# EAGLE design Thermocouple_datalogger_RevA (EAGLE 7.5.0)
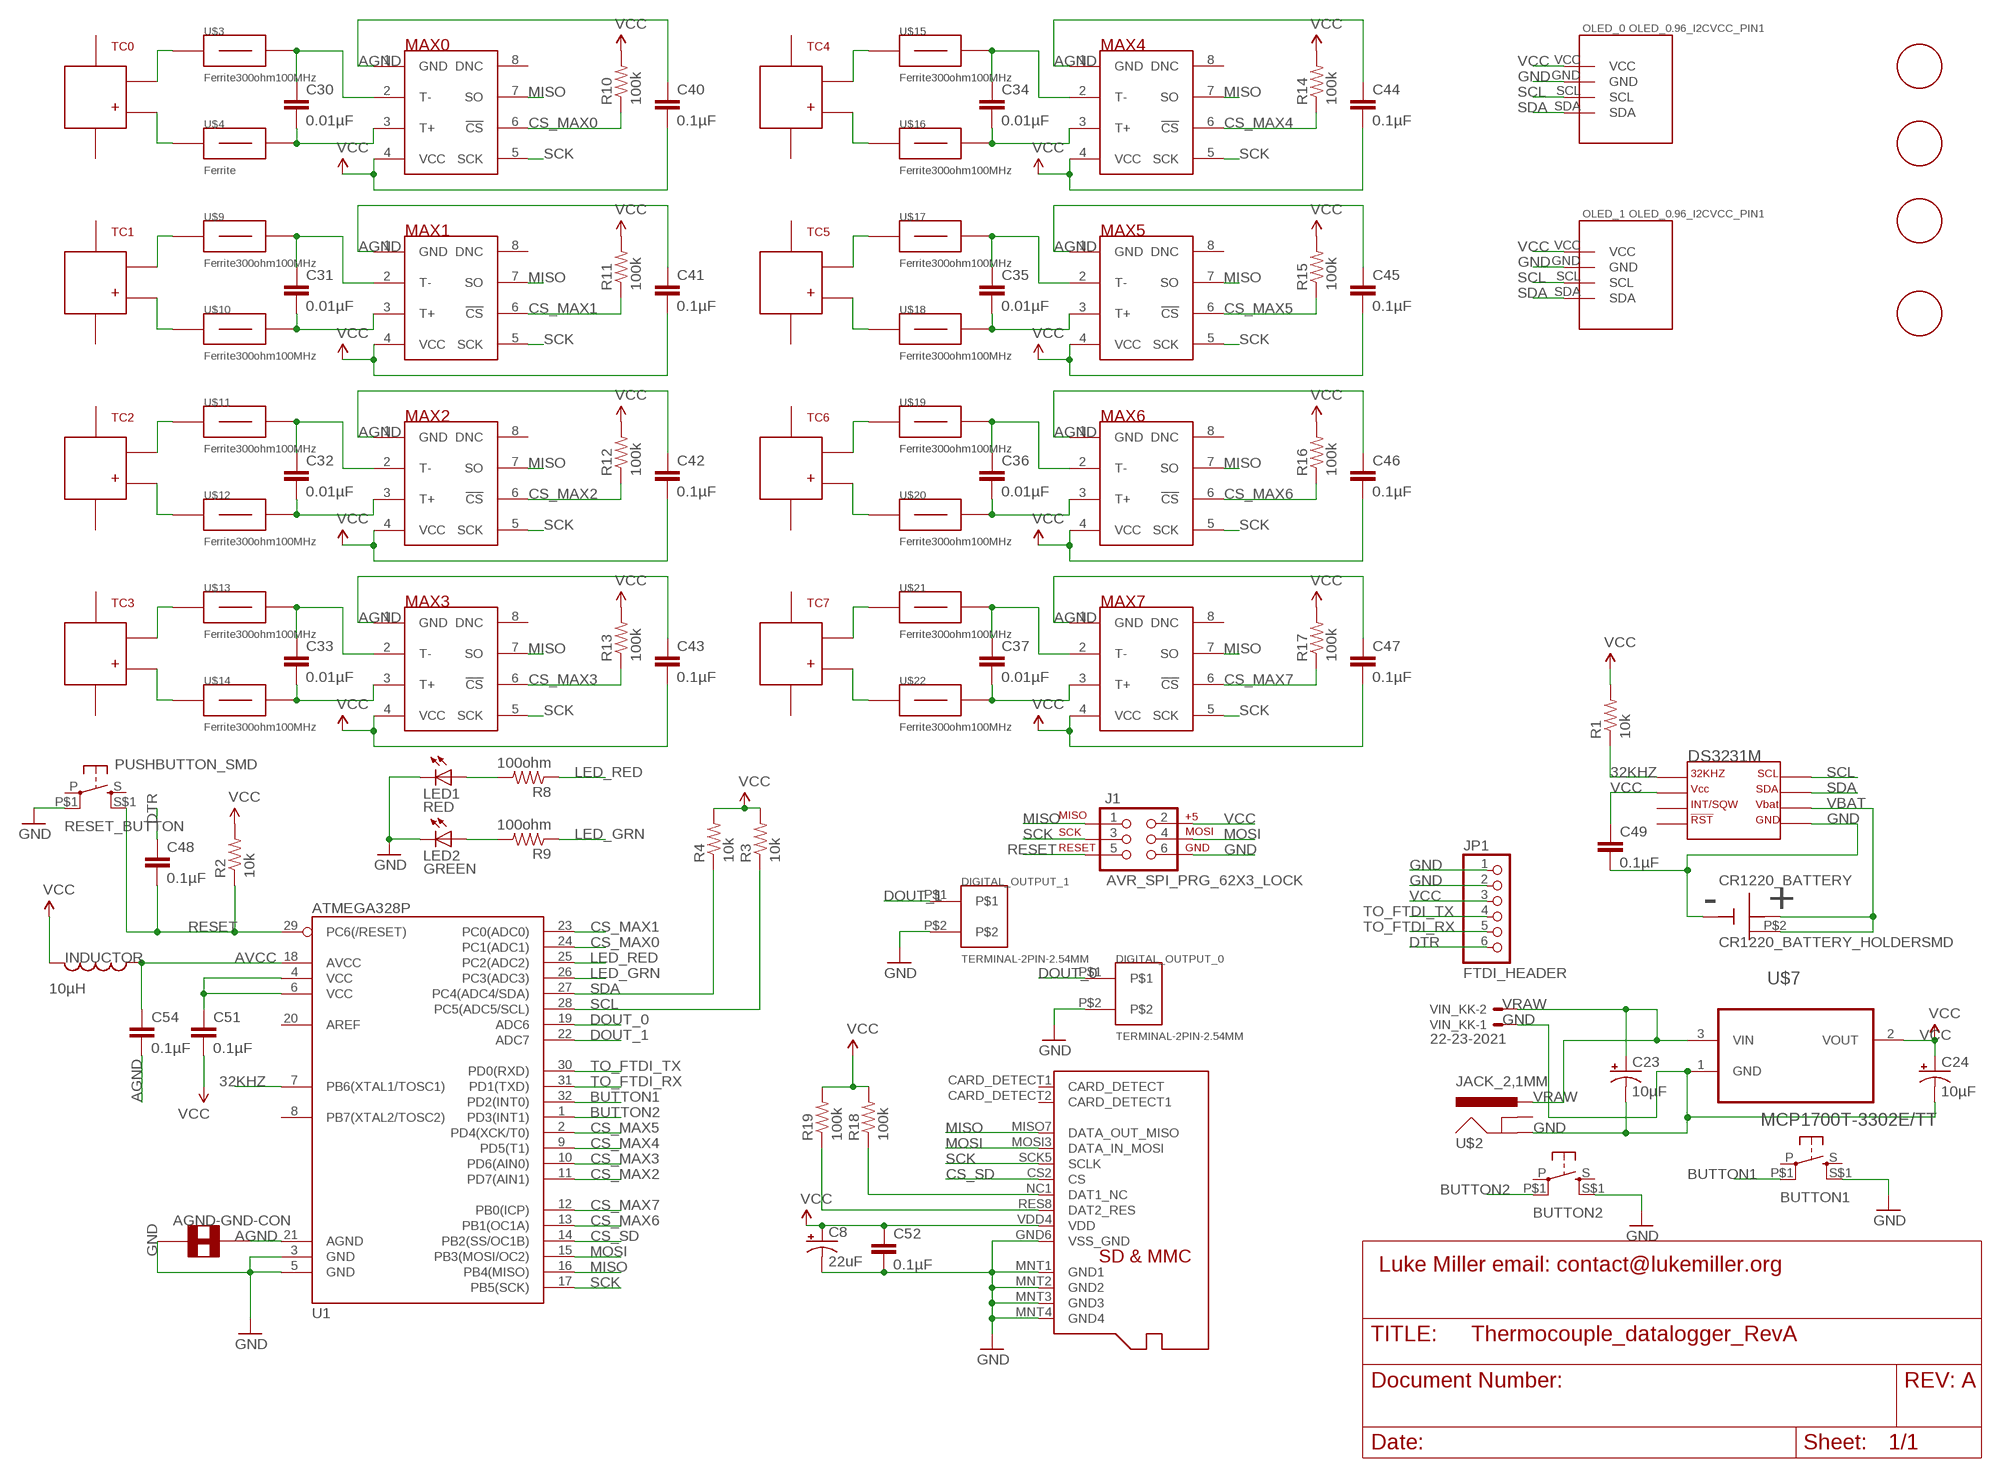
[diagram p0: schematic, sheet 1]

## Parts
AGND-GND-CON  SOLDER_JUMPER_TRACESTANDARD  [SJ_2S-TRACE]
BUTTON1  PUSHBUTTON_DPST_SMDSTANDARD  [PUSHBUTTON_DPST_SMD]
BUTTON2  PUSHBUTTON_DPST_SMDSTANDARD  [PUSHBUTTON_DPST_SMD]
C8  22uF  CPOL-US0805  [C0805_POL]
C23  10µF  CPOL-USB  [PANASONIC_B]
C24  10µF  CPOL-USB  [PANASONIC_B]
C30  0.01µF  CAP0805  [0805]
C31  0.01µF  CAP0805  [0805]
C32  0.01µF  CAP0805  [0805]
C33  0.01µF  CAP0805  [0805]
C34  0.01µF  CAP0805  [0805]
C35  0.01µF  CAP0805  [0805]
C36  0.01µF  CAP0805  [0805]
C37  0.01µF  CAP0805  [0805]
C40  0.1µF  CAP0805  [0805]
C41  0.1µF  CAP0805  [0805]
C42  0.1µF  CAP0805  [0805]
C43  0.1µF  CAP0805  [0805]
C44  0.1µF  CAP0805  [0805]
C45  0.1µF  CAP0805  [0805]
C46  0.1µF  CAP0805  [0805]
C47  0.1µF  CAP0805  [0805]
C48  0.1µF  CAP0805  [0805]
C49  0.1µF  CAP0805  [0805]
C51  0.1µF  CAP0805  [0805]
C52  0.1µF  CAP0805  [0805]
C54  0.1µF  CAP0805  [0805]
CR1220_BATTERY  CR1220_BATTERY_HOLDERSMD  [CR1220_BATTERY_HOLDER_SMD]
DIGITAL_OUTPUT_0  TERMINAL-2PIN-2.54MM  [TERMINAL-2PIN-2.54MM]
DIGITAL_OUTPUT_1  TERMINAL-2PIN-2.54MM  [TERMINAL-2PIN-2.54MM]
DS3231M  DS3231MSOIC-8  [DS3231M_SOIC8]
INDUCTOR  10µH  INDUCTOR0805_TY  [I_0805]
J1  AVR_SPI_PRG_62X3_LOCK  [2X3_LOCK]
JP1  FTDI_HEADER  PINHD-1X6LOCK  [1X06-BIGLOCK]
LED1  RED  LED0805  [CHIPLED_0805]
LED2  GREEN  LED0805  [CHIPLED_0805]
MAX0  MAX31855  [SO08]
MAX1  MAX31855  [SO08]
MAX2  MAX31855  [SO08]
MAX3  MAX31855  [SO08]
MAX4  MAX31855  [SO08]
MAX5  MAX31855  [SO08]
MAX6  MAX31855  [SO08]
MAX7  MAX31855  [SO08]
OLED_0  OLED_0.96_I2CVCC_PIN1  [OLED_0.96_I2C_VCC_PIN1]
OLED_1  OLED_0.96_I2CVCC_PIN1  [OLED_0.96_I2C_VCC_PIN1]
R1  10k  RESISTOR_SMDR0805  [R0805]
R2  10k  RESISTOR_SMDR0805  [R0805]
R3  10k  RESISTOR_SMDR0805  [R0805]
R4  10k  RESISTOR_SMDR0805  [R0805]
R8  100ohm  RESISTOR_SMDR0805  [R0805]
R9  100ohm  RESISTOR_SMDR0805  [R0805]
R10  100k  RESISTOR_SMDR0805  [R0805]
R11  100k  RESISTOR_SMDR0805  [R0805]
R12  100k  RESISTOR_SMDR0805  [R0805]
R13  100k  RESISTOR_SMDR0805  [R0805]
R14  100k  RESISTOR_SMDR0805  [R0805]
R15  100k  RESISTOR_SMDR0805  [R0805]
R16  100k  RESISTOR_SMDR0805  [R0805]
R17  100k  RESISTOR_SMDR0805  [R0805]
R18  100k  RESISTOR_SMDR0805  [R0805]
R19  100k  RESISTOR_SMDR0805  [R0805]
RESET_BUTTON  PUSHBUTTON_SMD  PUSHBUTTON_DPST_SMDSTANDARD  [PUSHBUTTON_DPST_SMD]
TC0  PCC-SMP-THERMOCOUPLEVERTICAL  [PCC-SMP-V]
TC1  PCC-SMP-THERMOCOUPLEVERTICAL  [PCC-SMP-V]
TC2  PCC-SMP-THERMOCOUPLEVERTICAL  [PCC-SMP-V]
TC3  PCC-SMP-THERMOCOUPLEVERTICAL  [PCC-SMP-V]
TC4  PCC-SMP-THERMOCOUPLEVERTICAL  [PCC-SMP-V]
TC5  PCC-SMP-THERMOCOUPLEVERTICAL  [PCC-SMP-V]
TC6  PCC-SMP-THERMOCOUPLEVERTICAL  [PCC-SMP-V]
TC7  PCC-SMP-THERMOCOUPLEVERTICAL  [PCC-SMP-V]
U1  ATMEGA328P  ATMEGA328_SMT  [TQFP32-08]
U$2  JACK_2,1MM  POWER_JACK_2,1MM  [POWER_JACK_DC_2,1MM]
U$3  Ferrite300ohm100MHz  FERRITE_BEAD0805  [0805]
U$4  Ferrite  FERRITE_BEAD0805  [0805]
U$5  MICROSD_MOLEX_REVERSECURRENT  [MICROSD_SOCKET_MOLEX_REVERSEMOUNT]
U$6  HOLE-LAYOUT4-40-SOCKET-HEAD  [4-40-SCREW-HOLE]
U$7  MCP1700T-3302E/TT  [SOT95P237X112-3N]
U$9  Ferrite300ohm100MHz  FERRITE_BEAD0805  [0805]
U$10  Ferrite300ohm100MHz  FERRITE_BEAD0805  [0805]
U$11  Ferrite300ohm100MHz  FERRITE_BEAD0805  [0805]
U$12  Ferrite300ohm100MHz  FERRITE_BEAD0805  [0805]
U$13  Ferrite300ohm100MHz  FERRITE_BEAD0805  [0805]
U$14  Ferrite300ohm100MHz  FERRITE_BEAD0805  [0805]
U$15  Ferrite300ohm100MHz  FERRITE_BEAD0805  [0805]
U$16  Ferrite300ohm100MHz  FERRITE_BEAD0805  [0805]
U$17  Ferrite300ohm100MHz  FERRITE_BEAD0805  [0805]
U$18  Ferrite300ohm100MHz  FERRITE_BEAD0805  [0805]
U$19  Ferrite300ohm100MHz  FERRITE_BEAD0805  [0805]
U$20  Ferrite300ohm100MHz  FERRITE_BEAD0805  [0805]
U$21  Ferrite300ohm100MHz  FERRITE_BEAD0805  [0805]
U$22  Ferrite300ohm100MHz  FERRITE_BEAD0805  [0805]
U$23  HOLE-LAYOUT4-40-SOCKET-HEAD  [4-40-SCREW-HOLE]
U$24  HOLE-LAYOUT4-40-SOCKET-HEAD  [4-40-SCREW-HOLE]
U$25  HOLE-LAYOUT4-40-SOCKET-HEAD  [4-40-SCREW-HOLE]
VIN_KK  22-23-2021  [22-23-2021]

## Nets
32KHZ: DS3231M.1(P$1_32KHZ) R1.1 U1.7(PB6(XTAL1/TOSC1))
AGND: AGND-GND-CON.2 C40.1 C41.1 C42.1 C43.1 C44.1 C45.1 C46.1 C47.1 C54.2 MAX0.1(GND) MAX1.1(GND) MAX2.1(GND) MAX3.1(GND) MAX4.1(GND) MAX5.1(GND) MAX6.1(GND) MAX7.1(GND) U1.21(AGND)
AVCC: C54.1 INDUCTOR.P$1 U1.18(AVCC)
BUTTON1: BUTTON1.P$1(P1) U1.32(PD2(INT0))
BUTTON2: BUTTON2.P$1(P1) U1.1(PD3(INT1))
CS_MAX0: MAX0.6(!CS) R10.1 U1.24(PC1(ADC1))
CS_MAX1: MAX1.6(!CS) R11.1 U1.23(PC0(ADC0))
CS_MAX2: MAX2.6(!CS) R12.1 U1.11(PD7(AIN1))
CS_MAX3: MAX3.6(!CS) R13.1 U1.10(PD6(AIN0))
CS_MAX4: MAX4.6(!CS) R14.1 U1.9(PD5(T1))
CS_MAX5: MAX5.6(!CS) R15.1 U1.2(PD4(XCK/T0))
CS_MAX6: MAX6.6(!CS) R16.1 U1.13(PB1(OC1A))
CS_MAX7: MAX7.6(!CS) R17.1 U1.12(PB0(ICP))
CS_SD: U1.14(PB2(SS/OC1B)) U$5.CS2(CS)
DOUT_0: DIGITAL_OUTPUT_0.P$1 U1.19(ADC6)
DOUT_1: DIGITAL_OUTPUT_1.P$1 U1.22(ADC7)
DTR: C48.1 JP1.6
GND: AGND-GND-CON.1 BUTTON1.S$1(S1) BUTTON2.S$1(S1) C8.P$2_C(-) C23.- C24.- C49.2 C52.2 CR1220_BATTERY.GND DIGITAL_OUTPUT_0.P$2 DIGITAL_OUTPUT_1.P$2 DS3231M.5(P$5_GND) J1.6 JP1.1 JP1.2 LED1.C LED2.C OLED_0.GND OLED_1.GND RESET_BUTTON.P$1(P1) U1.3(GND) U1.5(GND) U$2.P$2(GND) U$5.GND6(VSS_GND) U$5.MNT1(GND1) U$5.MNT2(GND2) U$5.MNT3(GND3) U$5.MNT4(GND4) U$7.1(GND) VIN_KK.1
LED_GRN: R9.1 U1.26(PC3(ADC3))
LED_RED: R8.1 U1.25(PC2(ADC2))
MISO: J1.1 MAX0.7(SO) MAX1.7(SO) MAX2.7(SO) MAX3.7(SO) MAX4.7(SO) MAX5.7(SO) MAX6.7(SO) MAX7.7(SO) U1.16(PB4(MISO)) U$5.MISO7(DATA_OUT_MISO)
MOSI: J1.4 U1.15(PB3(MOSI/OC2)) U$5.MOSI3(DATA_IN_MOSI)
N$1: C30.1 MAX0.2(T-) U$3.2
N$2: C30.2 MAX0.3(T+) U$4.2
N$3: TC0.P$2 U$4.1
N$4: TC0.P$1 U$3.1
N$5: LED1.A R8.2
N$7: R19.1 U$5.RES8(DAT2_RES)
N$8: R18.1 U$5.NC1(DAT1_NC)
N$9: C51.1 U1.4(VCC) U1.6(VCC)
N$10: LED2.A R9.2
N$11: C31.1 MAX1.2(T-) U$9.2
N$12: C31.2 MAX1.3(T+) U$10.2
N$13: TC1.P$2 U$10.1
N$14: TC1.P$1 U$9.1
N$15: C32.1 MAX2.2(T-) U$11.2
N$16: C32.2 MAX2.3(T+) U$12.2
N$17: TC2.P$2 U$12.1
N$18: TC2.P$1 U$11.1
N$19: C33.1 MAX3.2(T-) U$13.2
N$20: C33.2 MAX3.3(T+) U$14.2
N$21: TC3.P$2 U$14.1
N$22: TC3.P$1 U$13.1
N$23: C34.1 MAX4.2(T-) U$15.2
N$24: C34.2 MAX4.3(T+) U$16.2
N$25: TC4.P$2 U$16.1
N$26: TC4.P$1 U$15.1
N$27: C35.1 MAX5.2(T-) U$17.2
N$28: C35.2 MAX5.3(T+) U$18.2
N$29: TC5.P$2 U$18.1
N$30: TC5.P$1 U$17.1
N$31: C36.1 MAX6.2(T-) U$19.2
N$32: C36.2 MAX6.3(T+) U$20.2
N$33: TC6.P$2 U$20.1
N$34: TC6.P$1 U$19.1
N$35: C37.1 MAX7.2(T-) U$21.2
N$36: C37.2 MAX7.3(T+) U$22.2
N$37: TC7.P$2 U$22.1
N$38: TC7.P$1 U$21.1
RESET: C48.2 J1.5 R2.1 RESET_BUTTON.S$1(S1) U1.29(PC6(/RESET))
SCK: J1.3 MAX0.5(SCK) MAX1.5(SCK) MAX2.5(SCK) MAX3.5(SCK) MAX4.5(SCK) MAX5.5(SCK) MAX6.5(SCK) MAX7.5(SCK) U1.17(PB5(SCK)) U$5.SCK5(SCLK)
SCL: DS3231M.8(P$8_SCL) OLED_0.SCL OLED_1.SCL R3.1 U1.28(PC5(ADC5/SCL))
SDA: DS3231M.7(P$7_SDA) OLED_0.SDA OLED_1.SDA R4.1 U1.27(PC4(ADC4/SDA))
TO_FTDI_RX: JP1.5 U1.31(PD1(TXD))
TO_FTDI_TX: JP1.4 U1.30(PD0(RXD))
VBAT: CR1220_BATTERY.P$1(VBAT) CR1220_BATTERY.P$2 DS3231M.6(P$6_VBAT)
VCC: C8.P$1_A(+) C24.+ C40.2 C41.2 C42.2 C43.2 C44.2 C45.2 C46.2 C47.2 C49.1 C51.2 C52.1 DS3231M.2(P$2_VCC) INDUCTOR.P$2 J1.2 JP1.3 MAX0.4(VCC) MAX1.4(VCC) MAX2.4(VCC) MAX3.4(VCC) MAX4.4(VCC) MAX5.4(VCC) MAX6.4(VCC) MAX7.4(VCC) OLED_0.VCC OLED_1.VCC R1.2 R2.2 R3.2 R4.2 R10.2 R11.2 R12.2 R13.2 R14.2 R15.2 R16.2 R17.2 R18.2 R19.2 U$5.VDD4(VDD) U$7.2(VOUT)
VRAW: C23.+ U$2.P$1(PWR) U$7.3(VIN) VIN_KK.2
Unconnected: BUTTON1.P BUTTON1.S BUTTON2.P BUTTON2.S DS3231M.3(P$3_INT) DS3231M.4(P$4_RST) MAX0.8(DNC) MAX1.8(DNC) MAX2.8(DNC) MAX3.8(DNC) MAX4.8(DNC) MAX5.8(DNC) MAX6.8(DNC) MAX7.8(DNC) RESET_BUTTON.P RESET_BUTTON.S TC0.P$3 TC0.P$4 TC1.P$3 TC1.P$4 TC2.P$3 TC2.P$4 TC3.P$3 TC3.P$4 TC4.P$3 TC4.P$4 TC5.P$3 TC5.P$4 TC6.P$3 TC6.P$4 TC7.P$3 TC7.P$4 U1.8(PB7(XTAL2/TOSC2)) U1.20(AREF) U$2.P$3(GNDBREAK) U$5.CARD_DETECT1(CARD_DETECT) U$5.CARD_DETECT2(CARD_DETECT1)

## Library data of the parts
AGND-GND-CON = miller:SOLDER_JUMPER_TRACE: Solder jumper with trace Treat this like a zero ohm resistor. The trace can be cut with a knife.
BUTTON1 BUTTON2 RESET_BUTTON = miller:PUSHBUTTON_DPST_SMD: PUSHBUTTON DPST SMD Omron B3S-1000 Digikey PN SW836CT-ND This is your standard "hobbyist" style momentary pushbutton in a surface mount package.
C8 C23 C24 = miller:CPOL-US: POLARIZED CAPACITOR, American symbol
C30-C37 C40-C49 C51 C52 C54 = miller:CAP: Capacitor Standard surface mount ceramic capacitor and 0.1" leaded capacitor.
CR1220_BATTERY = miller:CR1220_BATTERY_HOLDER: CR1220 Battery Holder Keystone Part # 3001 Digikey 3001K-ND
DIGITAL_OUTPUT_0 DIGITAL_OUTPUT_1 = miller:TERMINAL-2PIN-2.54MM: Terminal block 0.1" spacing Example: On Shore Technology PN OSTVN02A150 Digikey PN ED10561-ND
DS3231M = miller:DS3231M: DS3231M real time clock Battery backup, 2.3V to 5.5V supply voltage 1Hz and 32.768kHz outputs NOTE: This is a slightly lower cost version of the regular DS3231S, with fewer clock frequency output options and slightly lower long-term time accuracy. It uses the same I2C communications protocol as the DS3231S, and is available in a small SOIC-8 package or Wide SOIC-16 (0.300") package. Maxim PN DS3231MZ+ SOIC-8 package Maxim PN DS3231M+ SOIC-16 Wide package
INDUCTOR = miller:INDUCTOR: Inductor Example: Taiyo Yuden PN LBR2012T100K
J1 = miller:AVR_SPI_PRG_6: AVR ISP 6 Pin This is the reduced ISP connector for AVR programming. Common on Arduino. This footprint will take up less PCB space and can be used with a 10-pin to 6-pin adapter such as SKU: BOB-08508 **Special note about "TEST_POINT" package. The stop mask is on the top side, so if you want your programming test points to be on the bottom of your board, make sure to place this package on the bottom side of the board. This also ensure that the orientation to program from the bottom side will be correct.
JP1 = miller:PINHD-1X6: PIN HEADER
LED1 LED2 = miller:LED: LEDs Standard schematic elements and footprints for 5mm, 3mm, 1206, and 0603 sized LEDs. 5mm - Spark Fun Electronics SKU : COM-00529 (and others)
MAX0 MAX1-MAX7 = miller:MAX31855: MAX31855 Thermocouple amplifier with cold junction compensation, SPI communication Maxim-ic PN MAX31855 (thermocouple code is appended at end of PN) Digikey PN MAX31855K, MAX31855T, MAX31855J etc. Surface mount, 8-SOIC Narrow, 3.0 to 3.6V supply
OLED_0 OLED_1 = miller:OLED_0.96_I2C: CHECK VCC & GND PIN VARIANT OLED 128x64 0.96" I2C module Generic 4-pin I2C OLED module from ebay/amazon etc. SSD1306 driver
R1-R4 R8-R19 = miller:RESISTOR_SMD: RESISTOR, American symbol
TC0 TC1-TC7 = miller:PCC-SMP-THERMOCOUPLE: PCC-SMP Miniature thermocouple mount connector. Omega Engineering PCC-SMP or PCC-SMP-V (vertical mount)
U1 = miller:ATMEGA328_SMT: 32-Pin Atmega328
U$2 = miller:POWER_JACK_2,1MM: DC Power Jack, 2.1mm center pin. Digikey PN CP-202AH-ND
U$3 U$4 U$9-U$22 = miller:FERRITE_BEAD: Ferrite bead Example: TDK Corp PN MMZ2012R301AT000, Digikey PN 445-2191-1-ND
U$5 = miller:MICROSD_MOLEX_REVERSE: Molex micro SD connector, push-push spring loaded, "reverse" mount Pins accessible at rear of case. Active: Molex PN 5027740891 Digikey PN WM24066CT-ND Obsolete: Molex PN 49225-201
U$6 U$23-U$25 = miller:HOLE-LAYOUT: Drill hole
U$7 = Microchip_By_element14_Batch_1:MCP1700T-3302E/TT: Low Quiescent Current LDO; MPN: MCP1700T-3302E/TT; OC_FARNELL: 1296592; OC_NEWARK: 88H9817; PACKAGE: SOT23-3; SUPPLIER: Microchip
VIN_KK = miller:22-23-2021: Molex KK series .100" (2.54mm) Center Header - 2 Pin; MF: MOLEX; MPN: 22-23-2021; OC_FARNELL: 1462926; OC_NEWARK: 25C3832

## Board
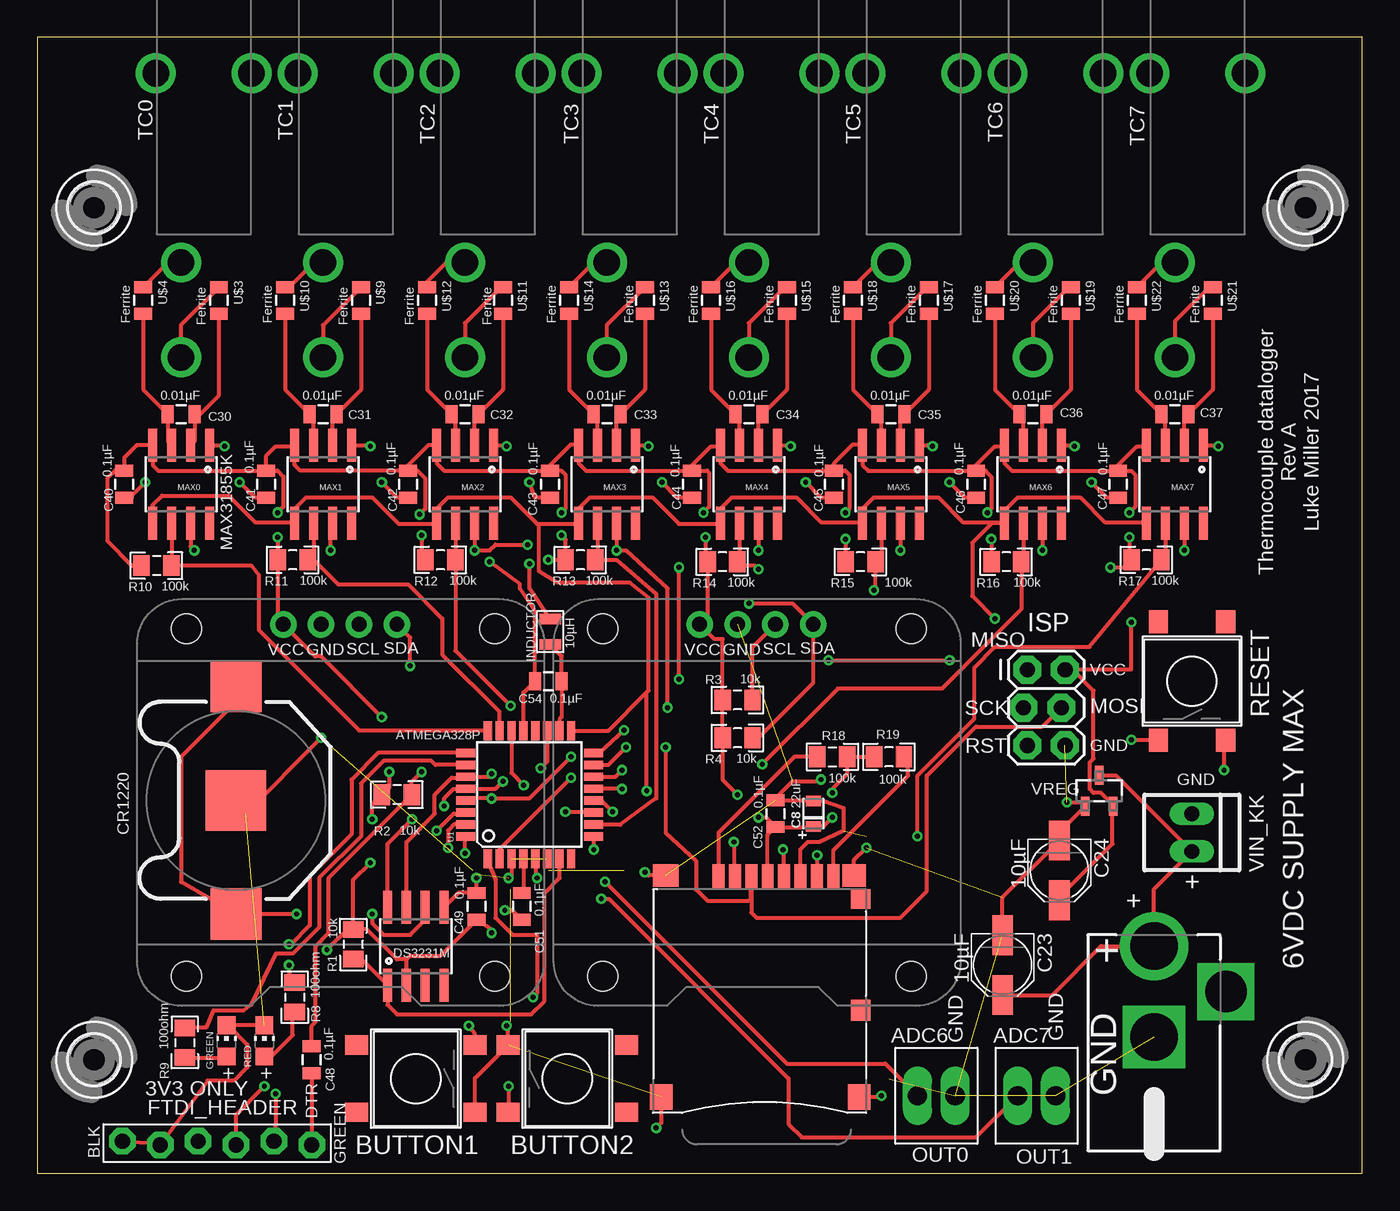
[diagram p1: board, top side]
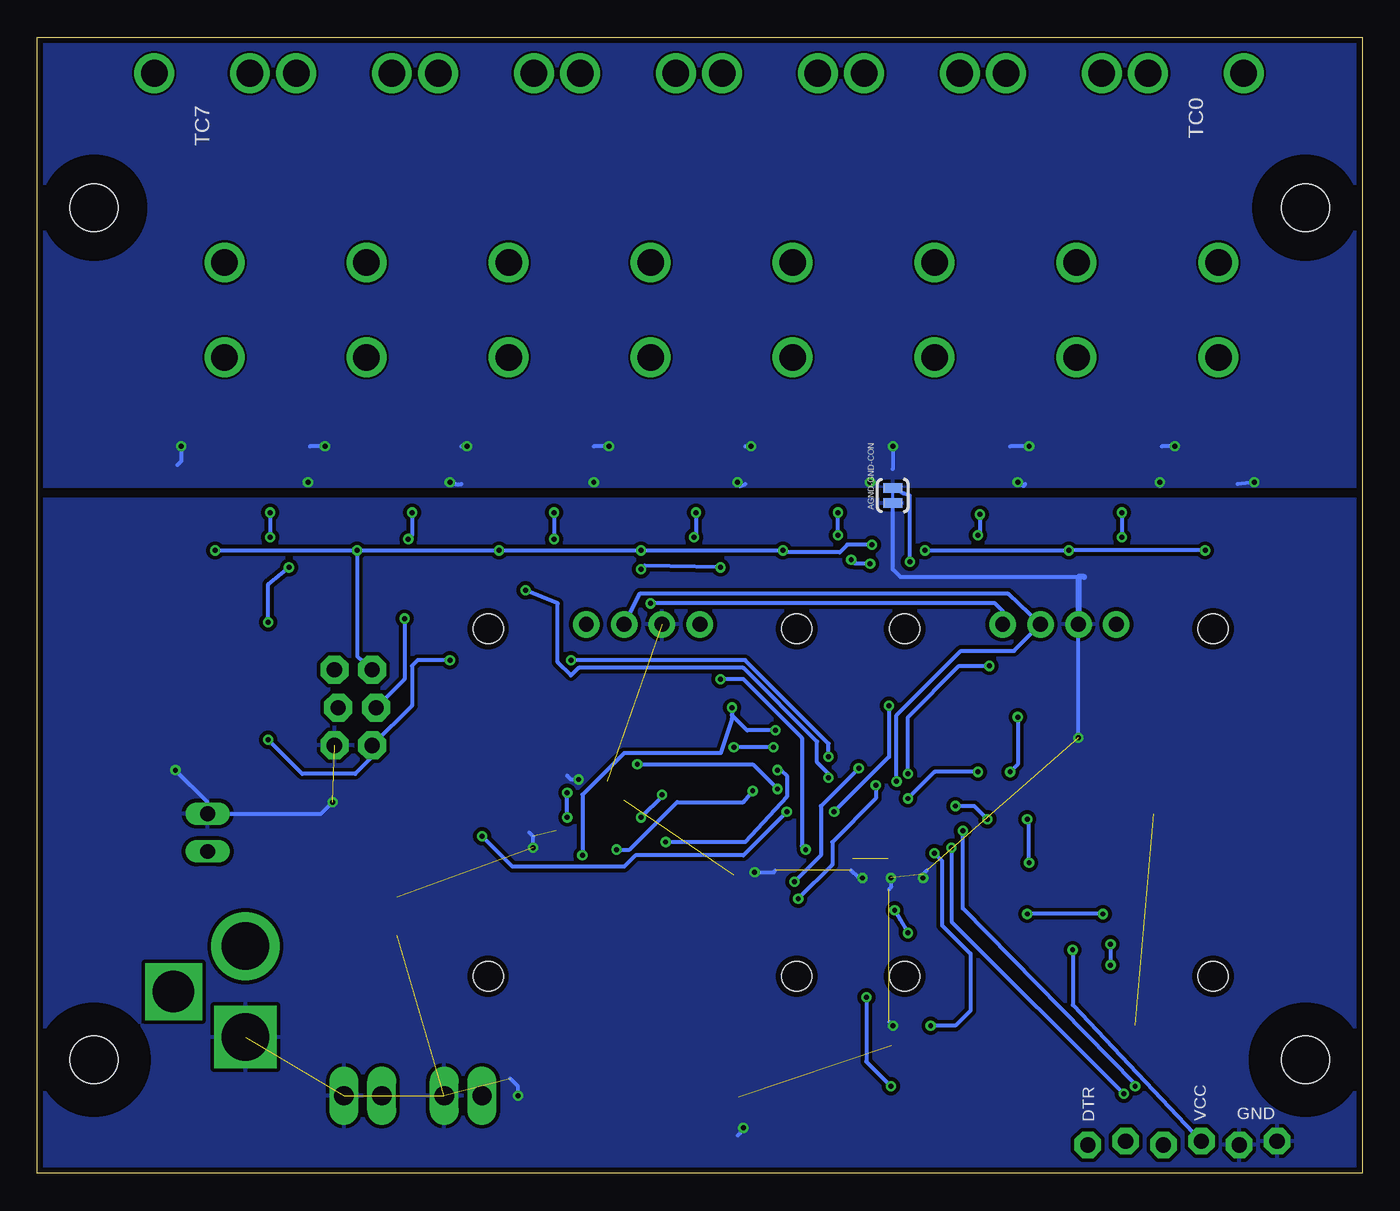
[diagram p2: board, bottom side, seen from below]

Size 88.9 x 76.2 mm. Coordinates in mm from the lower left corner, seen from the top.
Outline: 0,0 88.9,0 88.9,76.2 0,76.2 0,0
Copper layers (1*16): Top 0.0356mm / dielectric 1.5011mm / Bottom 0.0356mm
Design rules "LaenPCBOrder *": minimum track width 6mil, minimum drill 13mil, track to track 6mil, track to pad 6mil, pad to pad 6mil, via to via 6mil, smd to smd 6mil, copper to edge 15mil, drill to drill 6mil, minimum pad ring 7mil, minimum via ring 7mil, stop-mask expansion 3mil, vias tented up to drill 30mil, thermal gap 10mil

### Footprints (pad centres in the part's own frame; a part is rotated, then mirrored left to right if it is on the bottom)
SJ_2S-TRACE = smd 0.635 x 1.27: 1 -0.508,0; 2 0.508,0
PUSHBUTTON_DPST_SMD = smd 1.55 x 1.3: P 3.975,-2.25; P$1 -3.975,-2.25; S 3.975,2.25; S$1 -3.975,2.25
C0805_POL = smd 0.7 x 1: P$1_A -0.85,0; P$2_C 0.85,0
PANASONIC_B = smd 2.667 x 1.4: + 2.006,0; - -2.006,0
0805 = smd 0.8 x 1.2: 1 -0.9,0; 2 0.9,0
CR1220_BATTERY_HOLDER_SMD = smd 4.064 x 4.064: GND 0,0 | smd 3.429 x 3.429: P$1 -7.62,0; P$2 7.62,0
TERMINAL-2PIN-2.54MM = drill 1.3 pad 1.778 long: P$1 -1.27,0; P$2 1.27,0
DS3231M_SOIC8 = smd 0.61 x 2.21: 1 -1.905,-2.616; 2 -0.635,-2.616; 3 0.635,-2.616; 4 1.905,-2.616; 5 1.905,2.616; 6 0.635,2.616; 7 -0.635,2.616; 8 -1.905,2.616
I_0805 = smd 0.7 x 1.45: P$1 -0.85,0; P$2 0.85,0
2X3_LOCK = drill 1.016 pad 1.88 octagon: 1 0,0; 2 0,2.54; 3 2.54,-0.254; 4 2.54,2.286; 5 5.08,0; 6 5.08,2.54
1X06-BIGLOCK = drill 1.016 pad 1.778 octagon: 1 -6.35,0.127; 2 -3.81,-0.127; 3 -1.27,0.127; 4 1.27,-0.127; 5 3.81,0.127; 6 6.35,-0.127
CHIPLED_0805 = smd 1.2 x 1.2: A 0,-1.05; C 0,1.05
SO08 = smd 0.61 x 2.21: 1 -1.905,-2.616; 2 -0.635,-2.616; 3 0.635,-2.616; 4 1.905,-2.616; 5 1.905,2.616; 6 0.635,2.616; 7 -0.635,2.616; 8 -1.905,2.616
OLED_0.96_I2C_VCC_PIN1 = drill 1 pad 1.778: GND -1.274,-0.003; SCL 1.266,-0.003; SDA 3.806,-0.003; VCC -3.814,-0.003 | hole 2: -10.314,-23.603; 10.386,-23.603; 10.386,-0.303; -10.314,-0.303
R0805 = smd 1.1 x 1.4: 1 -1,0; 2 1,0
PCC-SMP-V = drill 1.778: P$1 0,0; P$2 -6.35,0; P$3 -19.05,-1.702; P$4 -19.05,4.724
TQFP32-08 = smd 1.27 x 0.559: 1 -4.293,2.8; 2 -4.293,2; 3 -4.293,1.2; 4 -4.293,0.4; 5 -4.293,-0.4; 6 -4.293,-1.2; 7 -4.293,-2; 8 -4.293,-2.8; 17 4.293,-2.8; 18 4.293,-2; 19 4.293,-1.2; 20 4.293,-0.4; 21 4.293,0.4; 22 4.293,1.2; 23 4.293,2; 24 4.293,2.8 | smd 0.559 x 1.27: 9 -2.8,-4.293; 10 -2,-4.293; 11 -1.2,-4.293; 12 -0.4,-4.293; 13 0.4,-4.293; 14 1.2,-4.293; 15 2,-4.293; 16 2.8,-4.293; 25 2.8,4.293; 26 2,4.293; 27 1.2,4.293; 28 0.4,4.293; 29 -0.4,4.293; 30 -1.2,4.293; 31 -2,4.293; 32 -2.8,4.293
POWER_JACK_DC_2,1MM = drill 3.175 pad 4.572: P$1 0,0 | drill 3.175 square: P$2 6.096,0 | drill 2.8 square: P$3 3.048,4.826
MICROSD_SOCKET_MOLEX_REVERSEMOUNT = smd 1.29 x 1.4: CARD_DETECT1 -0.645,8.12 | smd 1.29 x 1.3: CARD_DETECT2 -0.645,0.65 | smd 0.8 x 1.68: CS2 7.8,-0.84; GND6 3.4,-0.84; MISO7 2.3,-0.84; MOSI3 6.7,-0.84; NC1 8.9,-0.84; RES8 1.2,-0.84; SCK5 4.5,-0.84; VDD4 5.6,-0.84 | smd 1.6 x 1.5: MNT1 -0.2,-0.93 | smd 1.7 x 1.5: MNT2 12.45,-0.93 | smd 1.5 x 1.7: MNT3 -0.54,13.92; MNT4 12.75,13.92
4-40-SCREW-HOLE = hole 3.2: 0,0
SOT95P237X112-3N = smd 0.559 x 1.27: 1 -0.94,-1.041; 2 0.94,-1.041; 3 0,1.041
22-23-2021 = drill 1 long: 1 -1.27,0; 2 1.27,0

### Placement (x,y rotation side)
AGND-GND-CON  31.5,45.47 90 bottom
BUTTON1  25.4,6.35 180 top
BUTTON2  35.56,6.35 0 top
C8  52.07,24.13 90 top
C23  64.77,13.97 270 top
C24  68.58,20.32 270 top
C30  9.65,50.93 180 top
C31  19.18,50.93 180 top
C32  28.7,50.93 180 top
C33  38.23,50.93 180 top
C34  47.75,50.93 180 top
C35  57.28,50.93 180 top
C36  66.8,50.93 180 top
C37  76.33,50.93 180 top
C40  5.84,46.23 90 top
C41  15.37,46.23 90 top
C42  24.89,46.23 90 top
C43  34.42,46.23 90 top
C44  43.94,46.23 90 top
C45  53.47,46.23 90 top
C46  62.99,46.23 90 top
C47  72.52,46.23 90 top
C48  18.41,7.62 90 top
C49  29.46,17.91 90 top
C51  32.51,17.91 270 top
C52  49.53,24.13 90 top
C54  34.29,33.02 180 top
CR1220_BATTERY  13.34,25.02 90 top
DIGITAL_OUTPUT_0  60.33,5.21 0 top
DIGITAL_OUTPUT_1  67.06,5.21 0 top
DS3231M  25.4,15.24 0 top
INDUCTOR  34.42,36.32 90 top
J1  66.42,33.78 270 top
JP1  12.06,2.03 0 top
LED1  15.24,8.89 0 top
LED2  12.7,8.89 0 top
MAX0  9.65,46.23 180 top
MAX1  19.18,46.23 180 top
MAX2  28.7,46.23 180 top
MAX3  38.23,46.23 180 top
MAX4  47.75,46.23 180 top
MAX5  57.28,46.23 180 top
MAX6  66.8,46.23 180 top
MAX7  76.33,46.23 180 top
OLED_0  20.32,36.83 0 top
OLED_1  48.26,36.83 0 top
R1  21.21,15.37 90 top
R2  24.13,25.4 180 top
R3  46.99,31.75 180 top
R4  46.99,29.21 180 top
R8  17.27,11.81 270 top
R9  9.91,8.76 270 top
R10  8,40.77 180 top
R11  17.14,41.15 180 top
R12  27.05,41.15 180 top
R13  36.45,41.15 180 top
R14  45.97,41.02 180 top
R15  55.24,41.02 180 top
R16  65.02,41.02 180 top
R17  74.42,41.15 180 top
R18  53.34,27.94 0 top
R19  57.15,27.94 180 top
RESET_BUTTON  77.47,33.02 90 top
TC0  9.65,54.74 270 top
TC1  19.18,54.74 270 top
TC2  28.7,54.74 270 top
TC3  38.23,54.74 270 top
TC4  47.75,54.74 270 top
TC5  57.28,54.74 270 top
TC6  66.8,54.74 270 top
TC7  76.33,54.74 270 top
U1  33.02,25.4 90 top
U$2  74.93,15.24 270 top
U$3  12.19,58.55 270 top
U$4  7.11,58.55 270 top
U$5  54.61,19.05 180 top
U$6  3.81,7.62 0 top
U$7  71.25,25.65 0 top
U$9  21.72,58.55 270 top
U$10  16.64,58.55 270 top
U$11  31.24,58.55 270 top
U$12  26.16,58.55 270 top
U$13  40.77,58.55 270 top
U$14  35.69,58.55 270 top
U$15  50.29,58.55 270 top
U$16  45.21,58.55 270 top
U$17  59.82,58.55 270 top
U$18  54.74,58.55 270 top
U$19  69.34,58.55 270 top
U$20  64.26,58.55 270 top
U$21  78.87,58.55 270 top
U$22  73.79,58.55 270 top
U$23  85.09,7.62 0 top
U$24  3.81,64.77 0 top
U$25  85.09,64.77 0 top
VIN_KK  77.47,22.86 270 top

### Tracks (layer width: path | path; a pad name or v marks a point on that pad's centre or on a via)
32KHZ
  Top 0.254: R1.1 21.75,14.37 DS3231M.1 23.5,11.3 24.13,10.67 33.15,10.67 34.04,11.56 34.04,18.8 35.05,19.81 35.05,21.07 U1.7
AGND  (via drill 0.33)
  Top 0.254: C40.1 6.34,45.33 6.34,45.45 v7.24,46.35 | U1.21 32.62,32.25 C54.2 33.39,37.73 32.38,39.24 32.38,39.5 v30.35,41.02 | C43.1 33.41,45.33 v33.02,46.35 | MAX2.1 31.42,48.84 v31.5,48.77 | C42.1 24.14,45.33 v23.11,46.35 | MAX1.1 22.28,48.84 v22.35,48.77 | C41.1 14.62,45.33 v13.59,46.35 | MAX0.1 12.5,48.84 v12.57,48.77 | C44.1 42.94,45.33 v41.91,46.35 | C45.1 52.59,45.33 v51.56,46.35 | C46.1 62.24,45.33 v61.21,46.35 | C47.1 71.77,45.33 v70.74,46.35 | MAX7.1 79.17,48.84 v79.25,48.77 | MAX6.1 69.52,48.84 v69.6,48.77 | MAX5.1 59.74,48.84 v60.07,48.77 | MAX4.1 50.34,48.84 v50.55,48.77 | MAX3.1 40.95,48.84 v41.02,48.77
  Bottom 0.254: v31.5,48.77 31.5,47.24 | v23.11,46.35 22.73,46.1 22.61,46.23 | v22.35,48.77 23.62,48.77 | v13.59,46.35 13.59,46.1 13.46,46.23 | v12.57,48.77 13.46,48.77 | v7.24,46.35 8.38,46.23 | v41.91,46.35 41.78,46.1 41.4,46.23 | v51.56,46.35 51.56,46.23 | v61.21,46.35 60.83,46.23 60.45,46.23 | v70.74,46.35 70.61,46.23 | v79.25,48.77 79.25,47.75 79.5,47.5 | v69.6,48.77 70.61,48.77 | v60.07,48.77 60.45,48.77 | v50.55,48.77 51.56,48.77 | v41.02,48.77 41.4,48.77 | v30.35,41.02 30.35,45.47 30.73,45.59 AGND-GND-CON.2 31.5,46.1
  pour Bottom: 0,46.1 88.9,46.1 88.9,76.2 0,76.2
AVCC
  Top 0.254: U1.18 35.05,29.73 35.05,30.48 35.19,30.62 C54.1 35.19,34.7 INDUCTOR.P$1
BUTTON1  (via drill 0.33)
  Top 0.254: BUTTON1.P$1 29.38,9.36 v28.96,9.91 | v28.7,21.46 28.7,22.57 U1.32
  Bottom 0.254: v28.7,21.46 28.19,20.95 28.19,16.64 26.29,14.73 26.29,10.92 27.3,9.91 v28.96,9.91
BUTTON2  (via drill 0.33)
  Top 0.254: U1.1 30.22,20.96 30.73,19.68 30.73,17.14 31.88,16 33.53,16 33.53,12.06 v33.27,11.81 | v31.62,5.84 31.62,4.14 BUTTON2.P$1
  Bottom 0.254: v33.27,11.81 33.27,7.49 v31.62,5.84
CS_MAX0
  Top 0.254: MAX0.6 9.02,40.78 | 9.02,40.78 R10.1 | 9.02,40.78 14.34,40.78 14.86,40.13 14.86,36.45 21.59,29.72 30.2,29.72 U1.24
CS_MAX1
  Top 0.254: MAX1.6 18.54,41.55 | 18.54,41.55 R11.1 | 18.54,41.55 18.54,41.15 20.19,39.5 24.89,39.5 27.18,37.21 27.18,34.8 30.99,30.99 30.99,29.73 U1.23
CS_MAX2  (via drill 0.33)
  Top 0.254: MAX2.6 28.07,41.16 | 28.07,41.16 R12.1 | 28.07,41.16 28.07,35.05 v31.75,31.37 | v35.43,24.26 37.26,24.26 U1.11
  Bottom 0.254: v31.75,31.37 31.75,27.94 v35.43,24.26
CS_MAX3
  Top 0.254: MAX3.6 37.59,41.29 R13.1 38.86,41.15 41.53,38.86 41.53,25.15 39.12,23.37 37.34,23.37 U1.10
CS_MAX4  (via drill 0.33)
  Top 0.254: MAX4.6 47.12,41.16 R14.1 47.23,40.77 48.13,40.77 v48.39,40.51 | U1.9 37.31,21.74 v37.34,21.72 | v43.05,33.15 v43.05,40.64
  Bottom 0.254: v43.05,33.15 41.53,33.15 37.59,29.21 37.59,21.97 v37.34,21.72 | v43.05,40.64 48.13,40.77 v48.39,40.51
CS_MAX5  (via drill 0.33)
  Top 0.254: MAX5.6 56.64,41.42 R15.1 56.24,39.37 v56.13,39.12 | U1.2 31.02,21.75 v35.81,26.54
  Bottom 0.254: v35.81,26.54 35.81,26.8 36.58,27.56 36.58,28.96 41.53,33.91 52.58,33.91 53.09,33.4 53.98,34.29 53.98,38.23 v56.13,39.12
CS_MAX6  (via drill 0.33)
  Top 0.254: MAX6.6 66.17,41.16 R16.1 66.02,37.83 60.71,32.51 53.72,32.51 v48.64,27.43 | v39.24,25.78 37.33,25.78 U1.13
  Bottom 0.254: v48.64,27.43 40.89,27.43 v39.24,25.78
CS_MAX7  (via drill 0.33)
  Top 0.254: MAX7.6 75.69,41.42 R17.1 70.6,35.31 64.26,35.31 62.87,33.91 62.87,30.48 59.05,26.67 v59.05,22.61 | U1.12 37.87,25 v38.61,24.26
  Bottom 0.254: v38.61,24.26 41.53,21.34 48.77,21.34 49.53,20.57 57.02,20.57 v59.05,22.61
CS_SD  (via drill 0.33)
  Top 0.254: U1.14 38.79,26.6 v39.24,27.05 | v46.74,22.23 46.74,19.96 U$5.CS2
  Bottom 0.254: v39.24,27.05 38.99,27.05 38.61,26.67 38.61,25.27 41.4,22.23 v46.74,22.23
DOUT_0  (via drill 0.33)
  Top 0.254: U1.19 34.22,27.62 v33.78,27.18 | v38.1,19.56 50.29,7.37 56.9,7.37 DIGITAL_OUTPUT_0.P$1
  Bottom 0.254: v33.78,27.18 36.32,24.64 36.32,21.34 v38.1,19.56
DOUT_1  (via drill 0.33)
  Top 0.254: U1.22 31.82,26.85 v32.64,26.04 | v37.85,18.41 38.35,18.41 50.42,6.35 50.42,3.3 51.31,2.41 62.99,2.41 DIGITAL_OUTPUT_1.P$1
  Bottom 0.254: v32.64,26.04 32.64,25.15 35.56,22.23 35.56,20.7 v37.85,18.41
DTR
  Top 0.254: C48.1 JP1.6
GND  (via drill 0.33)  (16 unrouted)
  Top 0.254: CR1220_BATTERY.GND 13.97,24.13 v19.05,29.21 | U$5.GND6 51.18,19.92 51.18,21.72 51.69,22.23 52.45,22.23 54.1,22.99 54.1,24.51 52.74,24.98 C8.P$2_C 52.02,25.03 C52.2 49.53,25.15 50.67,26.29 52.45,26.29 v52.58,26.42 | C23.- 64.77,18.52 C24.- 68.58,22.89 U$7.1 70.03,24.89 v69.09,24.89 | LED1.C LED2.C 12.79,9.94 14.1,8.64 14.1,7.11 13.21,6.22 11.43,6.22 JP1.2 8,2.03 JP1.1 | DS3231M.5 28.26,18.81 C49.2 v29.46,19.81 | BUTTON1.S$1 29.38,6.39 BUTTON2.S$1 31.59,9.82 v31.5,9.91 | v79.63,27.05 79.63,28.95 RESET_BUTTON.P$1 | U$5.MNT2 40.98,19.98 v40.77,20.19 | U1.3 31.82,20.01 v31.62,19.81 | U1.5 33.42,19.92 v33.53,19.81 | U$5.MNT4 41.86,3.38 v41.53,3.05 | U$5.MNT1 54.81,21.03 v55.63,21.84 | U$5.MNT3 56.56,5.13 v56.64,5.21
  Bottom 0.254: v19.05,29.21 OLED_0.GND | v69.09,24.89 69.85,24.13 VIN_KK.1 77.47,24.89 v79.63,27.05 | v40.77,20.19 39.5,20.19 39.37,20.32 | v31.62,19.81 31.62,19.18 31.75,19.05 | v33.53,19.81 33.78,19.81 34.29,20.32 | v29.46,19.81 29.46,20.07 29.21,20.32 | v31.5,9.91 31.75,10.16 | v41.53,3.05 41.53,2.92 41.91,2.54 | v52.58,26.42 53.09,26.42 53.34,26.67 | v55.63,21.84 55.63,22.61 55.88,22.86 | 18.67,40.01 30.99,40.01 31.5,40.51 AGND-GND-CON.1 | v56.64,5.21 56.64,5.84 57.15,6.35
  Bottom 0.406: 18.67,40.01 19.05,40.01 OLED_0.GND
  pour Bottom (isolate 0.254): 0,0 88.9,0 88.9,45.21 0,45.21
LED_GRN
  Top 0.254: U1.26 26.7,27.4 26.42,27.69 23.24,27.69 21.72,26.16 21.72,22.61 18.92,19.81 18.92,16.51 17.14,14.73 16,14.73 14.35,11.3 13.84,10.92 11.81,10.92 11.32,9.78 R9.1
LED_RED  (via drill 0.33)
  Top 0.254: U1.25 22.87,28.2 21.08,26.42 21.08,22.73 18.29,19.94 18.29,16.64 17.02,15.37 v16.89,15.37 | v16.89,13.97 16.89,13.19 R8.1
  Bottom 0.254: v16.89,15.37 v16.89,13.97
MISO  (via drill 0.33)
  Top 0.254: MAX0.7 10.29,42.04 v10.54,41.78 | v19.68,41.78 19.68,43.48 MAX1.7 | MAX2.7 v29.34,41.78 30.35,41.78 30.73,42.16 v32.89,42.16 | MAX3.7 v38.86,41.78 39.5,41.78 42.29,39.24 v42.29,31.24 | MAX4.7 v48.39,41.78 | MAX5.7 v57.91,41.78 | MAX6.7 v67.44,41.78 | MAX7.7 v76.96,41.78 | U1.16 37.73,28.2 v39.37,29.72 | v52.32,21.34 52.32,19.9 U$5.MISO7
  Bottom 0.254: v10.54,41.78 v19.68,41.78 v29.34,41.78 | v67.44,41.78 v57.91,41.78 v48.39,41.78 v38.86,41.78 38.73,41.66 35.05,41.66 34.54,42.16 v32.89,42.16 | v76.96,41.78 v67.44,41.78 | v42.29,31.24 42.29,30.73 | 42.29,30.73 42.29,30.48 43.05,28.19 49.53,28.19 52.32,25.4 v52.32,21.34 | v67.44,41.78 67.44,34.67 J1.1 | v39.37,29.72 41.27,29.72 42.29,30.73
MOSI  (via drill 0.33)
  Top 0.254: U1.15 38.32,27.4 v39.5,28.57 | v42.16,28.57 42.16,22.86 44.2,20.95 44.2,19.05 44.96,18.29 47.75,18.29 47.88,18.41 47.88,20.19 47.75,20.32 47.75,20.05 U$5.MOSI3 47.91,17.5 48.26,17.14 57.91,17.14 59.69,18.92 59.69,26.67 62.99,29.97 67.44,29.97 J1.4
  Bottom 0.254: v39.5,28.57 v42.16,28.57
N$1
  Top 0.254: MAX0.2 10.55,49.11 C30.1 10.92,50.93 12.19,52.2 U$3.2
N$2
  Top 0.254: U$4.2 7.11,52.57 C30.2 8.75,49.11 MAX0.3
N$3
  Top 0.254: TC0.P$2 8.75,61.09 U$4.1
N$4
  Top 0.254: TC0.P$1 9.65,56.91 U$3.1
N$5
  Top 0.254: LED1.A 15.71,7.84 17.14,9.27 17.14,10.68 R8.2
N$7
  Top 0.254: U$5.RES8 53.41,21.66 58.42,26.67 58.42,27.67 R19.1
N$8
  Top 0.254: R18.1 50.8,27.94 45.72,22.86 U$5.NC1
N$9  (1 unrouted)
  Top 0.254: U1.4 32.62,18.91 C51.1
N$10
  Top 0.254: R9.2 12.62,7.76 LED2.A
N$11
  Top 0.254: MAX1.2 19.81,50.66 C31.1 21.72,52.57 U$9.2
N$12
  Top 0.254: MAX1.3 18.54,50.66 C31.2 16.64,52.57 U$10.2
N$13
  Top 0.254: U$10.1 16.9,59.45 18.54,61.09 TC1.P$2
N$14
  Top 0.254: U$9.1 21.72,59.44 19.18,56.9 TC1.P$1
N$15
  Top 0.254: U$11.2 31.24,52.57 C32.1 29.34,50.66 MAX2.2
N$16
  Top 0.254: U$12.2 26.16,52.57 C32.2 28.07,50.66 MAX2.3
N$17
  Top 0.254: TC2.P$2 27.43,61.09 26.16,59.82 U$12.1
N$18
  Top 0.254: U$11.1 31.13,59.45 28.7,57.02 TC2.P$1
N$19
  Top 0.254: MAX3.2 38.86,50.66 C33.1 40.77,52.57 U$13.2
N$20
  Top 0.254: MAX3.3 37.59,50.66 C33.2 35.69,52.57 U$14.2
N$21
  Top 0.254: TC3.P$2 37.33,61.09 U$14.1
N$22
  Top 0.254: TC3.P$1 38.23,56.91 U$13.1
N$23
  Top 0.254: MAX4.2 48.39,50.66 C34.1 50.29,52.57 U$15.2
N$24
  Top 0.254: MAX4.3 47.12,50.66 C34.2 45.21,52.57 U$16.2
N$25
  Top 0.254: TC4.P$2 46.85,61.09 U$16.1
N$26
  Top 0.254: U$15.1 50.18,59.45 47.75,57.02 TC4.P$1
N$27
  Top 0.254: MAX5.2 57.91,50.66 C35.1 59.82,52.57 U$17.2
N$28
  Top 0.254: MAX5.3 56.64,50.66 C35.2 54.74,52.57 U$18.2
N$29
  Top 0.254: TC5.P$2 56.38,61.09 U$18.1
N$30
  Top 0.254: U$17.1 59.7,59.45 57.28,57.02 TC5.P$1
N$31
  Top 0.254: MAX6.2 67.44,50.66 C36.1 69.34,52.57 U$19.2
N$32
  Top 0.254: MAX6.3 66.17,50.66 C36.2 64.26,52.57 U$20.2
N$33
  Top 0.254: TC6.P$2 65.9,61.09 U$20.1
N$34
  Top 0.254: U$19.1 69.23,59.45 66.8,57.02 TC6.P$1
N$35
  Top 0.254: MAX7.2 76.96,50.66 C37.1 78.87,52.57 U$21.2
N$36
  Top 0.254: MAX7.3 75.69,50.66 C37.2 73.79,52.57 U$22.2
N$37
  Top 0.254: TC7.P$2 75.43,61.09 U$22.1
N$38
  Top 0.254: U$21.1 78.62,59.45 76.33,57.15 TC7.P$1
RESET  (via drill 0.33)
  Top 0.254: v25.78,26.92 25.13,26.27 R2.1 19.56,19.83 19.56,16.13 18.67,15.24 18.67,10.16 18.41,9.91 C48.2 | U1.29 28.87,25.15 v30.48,25.15 33.02,25.15 v35.81,27.94 | v73.41,29.08 75.18,29.08 RESET_BUTTON.S$1 | v53.09,34.42 v61.21,34.42
  Bottom 0.254: v25.78,26.92 28.7,26.92 v30.48,25.15 | v35.81,27.94 35.81,28.83 41.4,34.42 v53.09,34.42 | v61.21,34.42 63.37,34.42 63.75,34.04 63.75,31.37 J1.5 66.42,27.94 67.56,26.8 71.12,26.8 v73.41,29.08
SCK  (via drill 0.33)
  Top 0.254: MAX0.5 7.75,44.83 8.38,45.47 12.83,45.47 14.61,43.69 17.2,43.69 MAX1.5 17.27,44.58 18.03,45.34 22.48,45.34 24.26,43.56 26.75,43.56 MAX2.5 26.8,44.58 27.56,45.34 31.75,45.34 33.53,43.56 33.66,43.56 | 33.66,43.56 36.27,43.56 MAX3.5 36.32,44.58 37.08,45.34 41.27,45.34 43.05,43.56 45.8,43.56 MAX4.5 45.85,44.58 46.61,45.34 50.93,45.34 52.58,43.69 55.3,43.69 MAX5.5 55.37,44.58 56.13,45.34 60.45,45.34 62.1,43.69 64.82,43.69 MAX6.5 | MAX6.5 64.9,44.45 65.79,45.34 69.98,45.34 71.63,43.69 74.35,43.69 MAX7.5 | U1.17 38.33,29.69 40.89,32.26 | 33.66,43.56 33.66,40.39 34.92,39.62 39.75,39.62 41.02,38.61 41.02,32.38 40.96,32.32 40.89,32.26 | U$5.SCK5 50.11,21.64 v50.04,21.72 | MAX6.5 64.06,43.61 62.74,42.29 62.74,38.73 v64.26,37.21 | v40.89,25.65 40.89,32.26
  Bottom 0.254: v50.04,21.72 49.15,21.72 45.97,24.89 41.53,24.89 v40.89,25.65 | v64.26,37.21 64.26,33.15 J1.3
SCL  (via drill 0.33)
  Top 0.254: R3.1 47.99,35.29 OLED_1.SCL | DS3231M.8 23.5,22.1 v25.15,23.75 | v27.3,24.64 27.3,25.15 27.94,25.78 28.71,25.78 U1.28 30.75,25.8 v31.24,26.29
  Bottom 0.254: v25.15,23.75 26.04,24.64 v27.3,24.64 | v31.24,26.29 31.24,30.73 26.92,35.05 23.36,35.05 OLED_0.SCL 23.75,38.86 48.51,38.86 OLED_1.SCL
SDA  (via drill 0.33)
  Top 0.254: R4.1 48.39,29.21 52.07,32.89 OLED_1.SDA 50.66,38.23 v47.75,38.23 | DS3231M.7 24.77,22.23 26.67,24.13 26.67,25.4 27.81,26.54 28.67,26.54 U1.27 30.28,26.6 v30.48,26.8 | v25.02,34.04 25.02,35.93 OLED_0.SDA
  Bottom 0.254: v30.48,26.8 30.48,30.61 27.05,34.04 v25.02,34.04 | OLED_0.SDA 24.13,37.72 24.64,38.23 v47.75,38.23
TO_FTDI_RX  (via drill 0.33)
  Top 0.254: U1.31 27.97,23.4 27.56,22.99 v27.56,21.84 | v16,5.33 16,3.43 JP1.5
  Bottom 0.254: v27.56,21.84 27.56,16.89 v16,5.33
TO_FTDI_TX  (via drill 0.33)
  Top 0.254: JP1.4 13.34,3.94 v15.24,5.84 | v26.8,22.99 27.94,24.13 28.66,24.13 U1.30
  Bottom 0.254: v15.24,5.84 15.24,5.97 26.8,17.78 v26.8,22.99
VBAT  (via drill 0.33)
  Top 0.254: CR1220_BATTERY.P$2 12.7,30.99 9.65,27.94 9.65,19.56 CR1220_BATTERY.P$1 v17.4,17.4 | v22.48,17.4 22.48,16.76 23.24,16 25.02,16 26.04,17.02 DS3231M.6
  Bottom 0.254: v17.4,17.4 v22.48,17.4
VCC  (via drill 0.33)
  Top 0.254: R10.2 6.35,40.77 4.7,42.42 4.7,46.61 5.22,47.13 C40.2 5.84,48.01 6.68,48.84 MAX0.4 7.75,47.5 8.13,47.12 15.36,47.12 C41.2 | C41.2 15.37,48.13 16,48.77 17.2,48.77 MAX1.4 17.27,47.5 17.64,47.13 C42.2 | C42.2 24.89,47.5 26.24,48.84 MAX2.4 26.8,47.62 27.3,47.12 34.41,47.12 C43.2 | C43.2 34.42,47.5 35.81,48.9 36.27,48.9 MAX3.4 36.32,47.62 36.83,47.12 43.93,47.12 C44.2 | C44.2 43.94,47.5 45.21,48.77 45.77,48.77 MAX4.4 45.85,47.62 46.35,47.12 53.46,47.12 C45.2 | C45.2 53.47,47.62 54.74,48.9 55.32,48.9 MAX5.4 55.37,47.5 55.75,47.12 62.98,47.12 C46.2 | C46.2 62.99,47.5 64.26,48.77 64.82,48.77 MAX6.4 64.9,47.62 65.41,47.12 72.51,47.12 | 72.51,47.12 C47.2 72.52,47.5 73.79,48.77 74.35,48.77 MAX7.4 | R19.2 R18.2 54.36,27.92 54.36,26.8 53.34,25.78 v53.34,25.53 | C52.1 52.02,23.23 C8.P$1_A 52.74,23.28 v53.34,23.88 | U$5.VDD4 49.01,22.71 C52.1 | C24.+ 68.58,18.54 72.14,22.1 72.14,24.56 U$7.2 72.19,24.71 71.37,25.53 70.87,25.53 70.61,25.78 70.61,27.56 70.87,27.81 70.87,32.38 69.47,33.78 J1.2 73.41,33.78 v73.41,36.96 | DS3231M.2 24.77,14.35 | 24.77,14.35 25.02,14.61 27.06,14.61 C49.1 30.47,16.37 v30.48,16.13 | 24.77,14.35 24.13,14.35 22.1,16.38 21.23,16.38 R1.2 | R1.2 21.21,19.68 v22.35,20.83 | v22.48,23.75 22.48,24.75 R2.2 23.62,25.89 v23.62,26.92 | R1.2 20.81,16.37 v19.43,14.99 | v31.37,17.65 31.87,17.65 C51.2 | v72.01,40.64 72.91,40.64 R17.2 73.28,41.29 v73.28,42.67 | INDUCTOR.P$2 33.02,39.24 v33.02,40.89 | v34.29,41.15 R13.2 35.45,42.53 v35.18,42.8 | C43.2 34.43,47.12 35.18,47.12 35.43,46.86 35.43,44.58 v35.18,44.32 | C41.2 16.12,47.13 16.51,46.74 16.51,44.7 v16.13,44.32
  Top 0.254: v16.13,42.67 16.13,41.16 R11.2 16.14,37.19 OLED_0.VCC 18.66,34.67 19.05,34.67 v23.11,30.61 | C42.2 25.52,47.13 26.04,46.61 26.04,44.58 v25.65,44.2 | v25.78,42.8 25.78,41.42 R12.2 | C44.2 44.95,47.13 45.09,46.99 45.09,44.7 v44.7,44.32 | v44.83,42.67 44.83,41.16 R14.2 44.97,37.35 OLED_1.VCC 45.44,35.83 45.99,35.83 R3.2 R4.2 45.99,26.4 v46.99,25.4 | C45.2 54.22,47.13 54.48,46.86 54.48,44.58 v54.23,44.32 | v54.23,42.55 54.23,41.04 R15.2 | C46.2 63.62,47.13 64.01,46.74 64.01,44.58 v63.75,44.32 | v64.01,42.55 64.01,41.04 R16.2 | 72.51,47.12 73.41,47.12 73.66,46.86 73.66,44.7 v73.28,44.32 | v48.39,23.88 48.88,23.88 C52.1
  Bottom 0.254: v22.35,20.83 22.35,23.62 v22.48,23.75 | v19.43,14.99 19.43,11.3 JP1.3 | v30.48,16.13 30.99,17.02 v31.37,17.65 | v73.41,36.96 73.41,39.5 v72.01,40.64 | v33.02,40.89 34.04,40.89 v34.29,41.15 | v35.18,42.8 v35.18,44.32 35.18,44.45 | v53.34,23.88 v53.34,25.53 | v16.13,44.32 v16.13,42.67 | v25.65,44.2 25.65,42.93 v25.78,42.8 | v44.7,44.32 44.7,42.8 v44.83,42.67 | v54.23,44.32 v54.23,42.55 | v63.75,44.32 63.75,42.8 v64.01,42.55 | v73.28,44.32 v73.28,42.67 | v46.99,25.4 46.99,25.27 v48.39,23.88 | v23.11,30.61 23.11,27.43 v23.62,26.92
VRAW
  Top 0.254: U$7.3 72.36,26.7 VIN_KK.2 74.93,19.05 U$2.P$1 71.37,15.24 68.1,11.96 C23.+

### Text on the board
tNames: Ferrite | Ferrite | Ferrite | Ferrite | Ferrite | Ferrite | Ferrite | Ferrite | Ferrite | Ferrite | Ferrite | Ferrite | Ferrite | Ferrite | Ferrite | Ferrite | Thermocouple datalogger / Rev A / Luke Miller 2017 | MAX31855K | ISP | MISO | VCC | SCK | MOSI | RESET | RST | GND | CR1220 | GND | VREG | + | + | 6VDC SUPPLY MAX | ADC6 | GND | ADC7 | GND | + | + | 3V3 ONLY | DTR | BLK | GREEN | OUT0 | OUT1
bNames: TC0 | TC7 | VCC | DTR | GND